# EAGLE design ESP_PILOT (EAGLE 9.6.2)
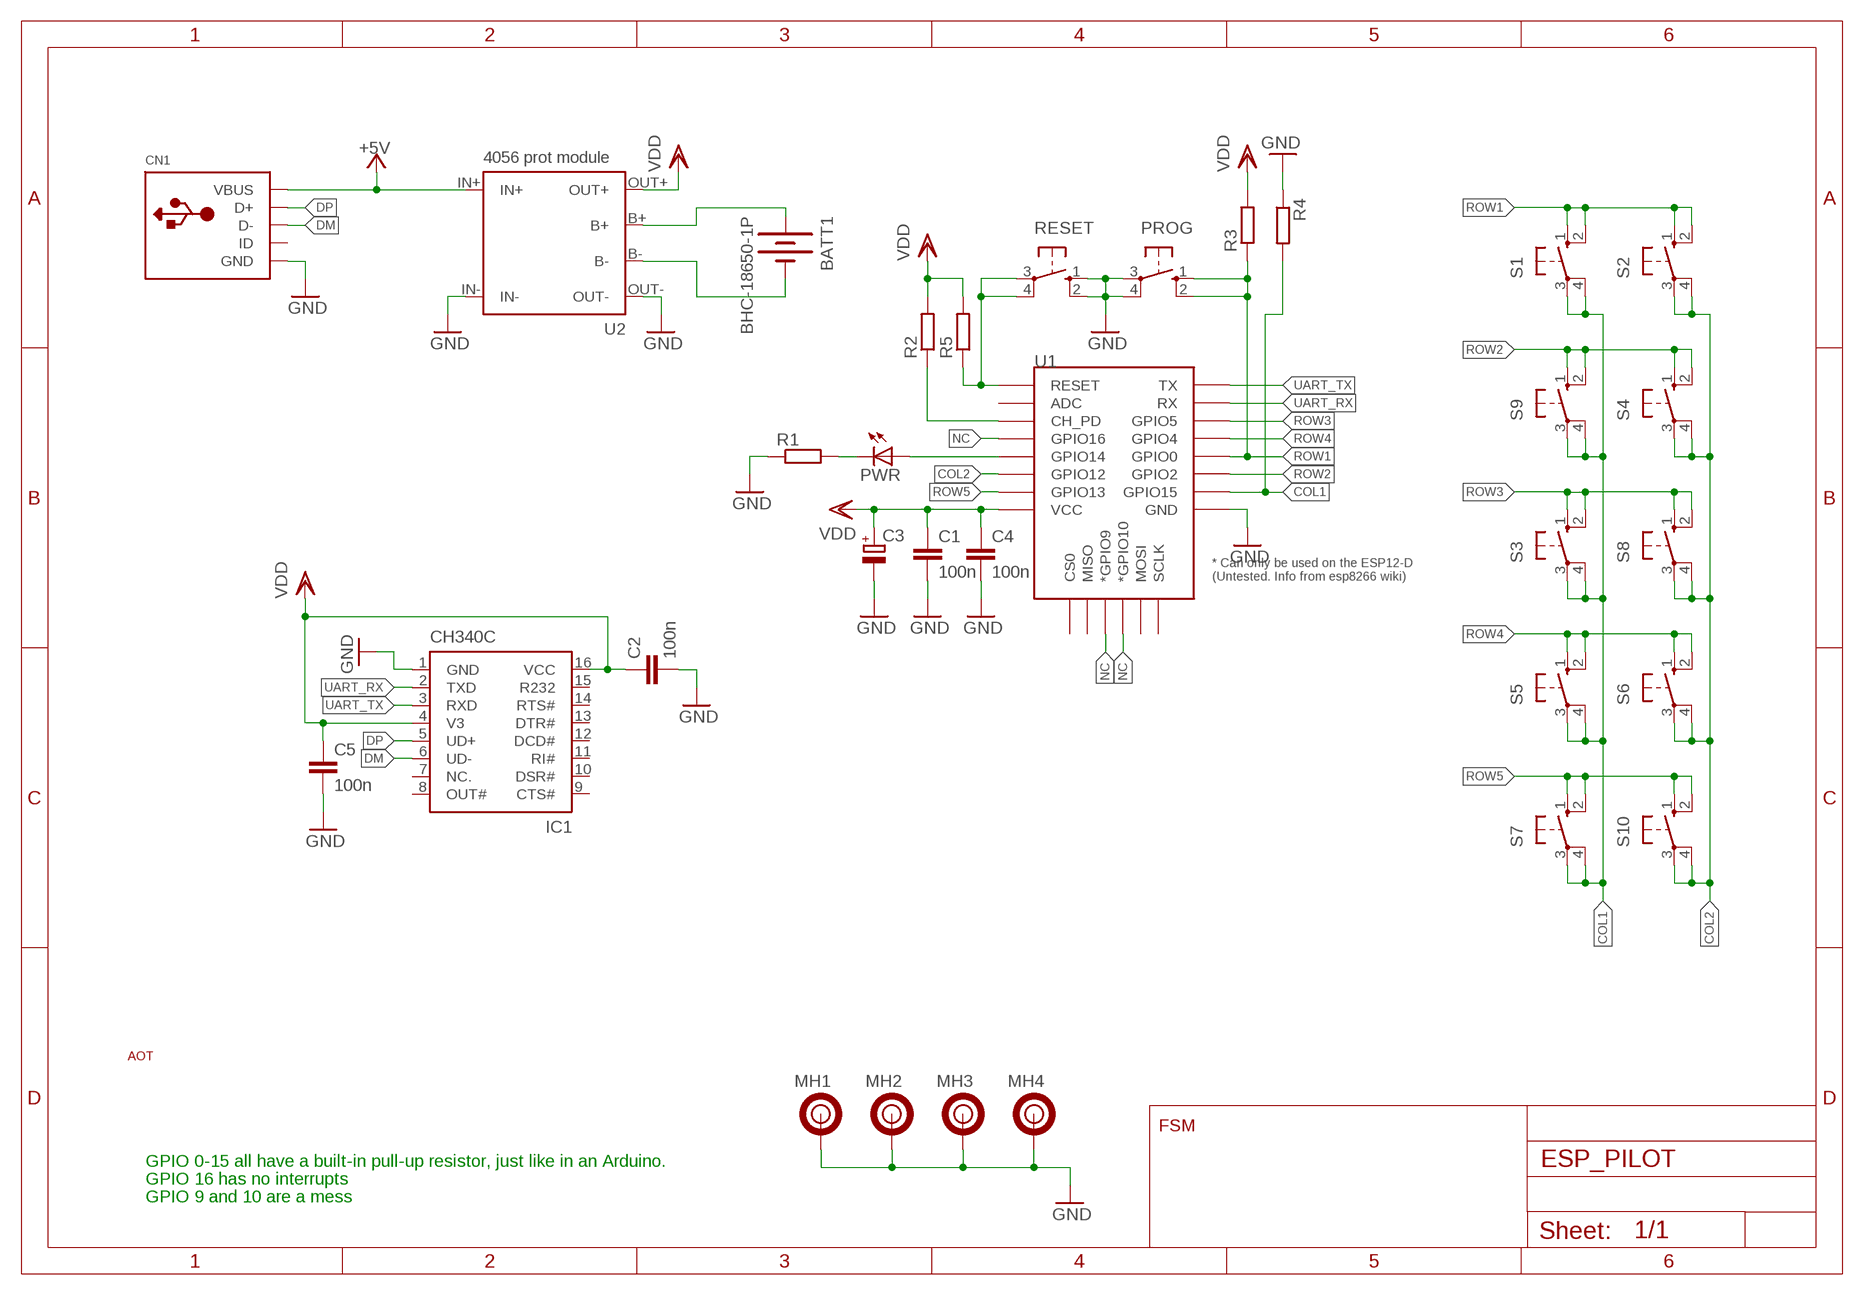
[diagram p0: schematic, sheet 1]

## Parts
BATT1  BHC-18650-1P  [BHC-18650-1P]
C1  100n  C-EU050-025X075  [C050-025X075]
C2  100n  C-EU050-025X075  [C050-025X075]
C3  CPOL-EUE2.5-7  [E2,5-7]
C4  100n  C-EU050-025X075  [C050-025X075]
C5  100n  C-EU050-025X075  [C050-025X075]
CN1  USBMINIB  [USB-MINIB]
IC1  CH340C  [SOIC16N]
MH1  MOUNTING_HOLE_3MM  [3MM_CONDUCTING]
MH2  MOUNTING_HOLE_3MM  [3MM_CONDUCTING]
MH3  MOUNTING_HOLE_3MM  [3MM_CONDUCTING]
MH4  MOUNTING_HOLE_3MM  [3MM_CONDUCTING]
PROG  10-XX  [B3F-10XX]
PWR  LED5MM  [LED5MM]
R1  R-EU_0207/10  [0207/10]
R2  R-EU_0207/10  [0207/10]
R3  R-EU_0207/10  [0207/10]
R4  R-EU_0207/10  [0207/10]
R5  R-EU_0207/10  [0207/10]
RESET  10-XX  [B3F-10XX]
S1  10-XX  [B3F-10XX]
S2  10-XX  [B3F-10XX]
S3  10-XX  [B3F-10XX]
S4  10-XX  [B3F-10XX]
S5  10-XX  [B3F-10XX]
S6  10-XX  [B3F-10XX]
S7  10-XX  [B3F-10XX]
S8  10-XX  [B3F-10XX]
S9  10-XX  [B3F-10XX]
S10  10-XX  [B3F-10XX]
U1  ESP12ESMD  [ESP12E-SMD]
U2  4056 prot module  TP4056_MICRO/MINI_PROT  [TP4056_MICRO/MINI_PROT]
U$1  FSM  [FSM]
U$2  AOT  [AOT]

## Nets
+5V: CN1.VBUS U2.IN+
COL1: R4.2 S1.3(P) S1.4(P1) S3.3(P) S3.4(P1) S5.3(P) S5.4(P1) S7.3(P) S7.4(P1) S9.3(P) S9.4(P1) U1.GPIO15
COL2: S2.3(P) S2.4(P1) S4.3(P) S4.4(P1) S6.3(P) S6.4(P1) S8.3(P) S8.4(P1) S10.3(P) S10.4(P1) U1.GPIO12
DM: CN1.D- IC1.6(UD-)
DP: CN1.D+ IC1.5(UD+)
GND: C1.2 C2.2 C3.- C4.2 C5.2 CN1.GND IC1.1(GND) MH1.1 MH1.2 MH1.3 MH1.4 MH1.5 MH1.6 MH1.7 MH1.8 MH1.O MH2.1 MH2.2 MH2.3 MH2.4 MH2.5 MH2.6 MH2.7 MH2.8 MH2.O MH3.1 MH3.2 MH3.3 MH3.4 MH3.5 MH3.6 MH3.7 MH3.8 MH3.O MH4.1 MH4.2 MH4.3 MH4.4 MH4.5 MH4.6 MH4.7 MH4.8 MH4.O PROG.3(P) PROG.4(P1) R1.1 R4.1 RESET.1(S) RESET.2(S1) U1.GND U2.IN- U2.OUT-
N$1: BATT1.-(+) U2.B+
N$2: BATT1.+(-) U2.B-
N$3: PWR.K(C) R1.2
N$4: R2.1 U1.CH_PD
N$5: PWR.A U1.GPIO14
N$7: R5.1 RESET.3(P) RESET.4(P1) U1.RESET
NC: U1.GPIO9(*GPIO9) U1.GPIO10(*GPIO10) U1.GPIO16
ROW1: PROG.1(S) PROG.2(S1) R3.1 S1.1(S) S1.2(S1) S2.1(S) S2.2(S1) U1.GPIO0
ROW2: S4.1(S) S4.2(S1) S9.1(S) S9.2(S1) U1.GPIO2
ROW3: S3.1(S) S3.2(S1) S8.1(S) S8.2(S1) U1.GPIO5
ROW4: S5.1(S) S5.2(S1) S6.1(S) S6.2(S1) U1.GPIO4
ROW5: S7.1(S) S7.2(S1) S10.1(S) S10.2(S1) U1.GPIO13
UART_RX: IC1.2(TXD) U1.RXD0(RX)
UART_TX: IC1.3(RXD) U1.TXD0(TX)
VDD: C1.1 C2.1 C3.+ C4.1 C5.1 IC1.4(V3) IC1.16(VCC) R2.2 R3.2 R5.2 U1.VCC U2.OUT+
Unconnected: CN1.ID IC1.7(NC.) IC1.8(OUT#) IC1.9(CTS#) IC1.10(DSR#) IC1.11(RI#) IC1.12(DCD#) IC1.13(DTR#) IC1.14(RTS#) IC1.15(R232) U1.ADC U1.CS0 U1.MISO U1.MOSI U1.SCLK

## Notes on the sheet
- GPIO 0-15 all have a built-in pull-up resistor, just like in an Arduino.
- GPIO 16 has no interrupts
- GPIO 9 and 10 are a mess

## Library data of the parts
BATT1 = battery:BHC-18650-1P: 18650 cell holder https://octopart.com/search?q=BHC-18650-1P&currency=USD&specs=0
C1 C2 C4 C5 = rcl:C-EU: CAPACITOR, European symbol; SPICEPREFIX: C
C3 = rcl:CPOL-EU: POLARIZED CAPACITOR, European symbol; SPICEPREFIX: C
CN1 = adafruit:USB: USB Connectors USBMINIB - Surface Mount Female Mini-B USB Connector 4UConnector: 06564 By microbuilder.eu Thru-hole RA Female Mini-B USB Connector 4UConnector: 18732 By ladyada.net
IC1 = CH340:CH340C; VALUE: CH340
MH1-MH4 = MOUNTING_PADS:MOUNTING_HOLE_3MM
PROG RESET S1-S10 = switch-omron:10-XX: OMRON SWITCH; MPN: B3F-1000; OC_FARNELL: 176432; OC_NEWARK: 36M3542
PWR = adafruit:LED: LED OSRAM: - CHIPLED LG R971, LG N971, LY N971, LG Q971, LY Q971, LO R971, LY R971 LH N974, LH R974 LS Q976, LO Q976, LY Q976 LO Q996 - Hyper CHIPLED LW Q18S LB Q993, LB Q99A, LB R99A - SideLED LS A670, LO A670, LY A670, LG A670, LP A670 LB A673, LV A673, LT A673, LW A673 LH A674 LY A675 LS A676, LA A676, LO A676, LY A676, LW A676 LS A679, LY A679, LG A679 - Hyper Micro SIDELED® LS Y876, LA Y876, LO Y876, LY Y876 LT Y87S - SmartLED LW L88C, LW L88S LB L89C, LB L89S, LG L890 LS L89K, LO L89K, LY L89K LS L896, LA L896, LO L896, LY L896 - TOPLED LS T670, LO T670, LY T670, LG T670, LP T670 LSG T670, LSP T670, LSY T670, LOP T670, LYG T670 LG T671, LOG T671, LSG T671 LB T673, LV T673, LT T673, LW T673 LH T674 LS T676, LA T676, LO T676, LY T676, LB T676, LH T676, LSB T676, LW T676 LB T67C, LV T67C, LT T67C, LS T67K, LO T67K, LY T67K, LW E67C LS E67B, LA E67B, LO E67B, LY E67B, LB E67C, LV E67C, LT E67C LW T67C LS T679, LY T679, LG T679 LS T770, LO T770, LY T770, LG T770, LP T770 LB T773, LV T773, LT T773, LW T773 LH T774 LS E675, LA E675, LY E675, LS T675 LS T776, LA T776, LO T776, LY T776, LB T776 LHGB T686 LT T68C, LB T68C - Hyper Mini TOPLED® LB M676 - Mini TOPLED Santana® LG M470 LS M47K, LO M47K, LY M47K Source: http://www.osram.convergy.de/
R1-R5 = rcl:R-EU_: RESISTOR, European symbol; SPICEPREFIX: R
U1 = esp8266modules:ESP12E: ESP12E Module
U2 = powerModules:TP4056_MICRO/MINI_PROT
U$1 = FSM:FSM
U$2 = AOT:AOT

## Board
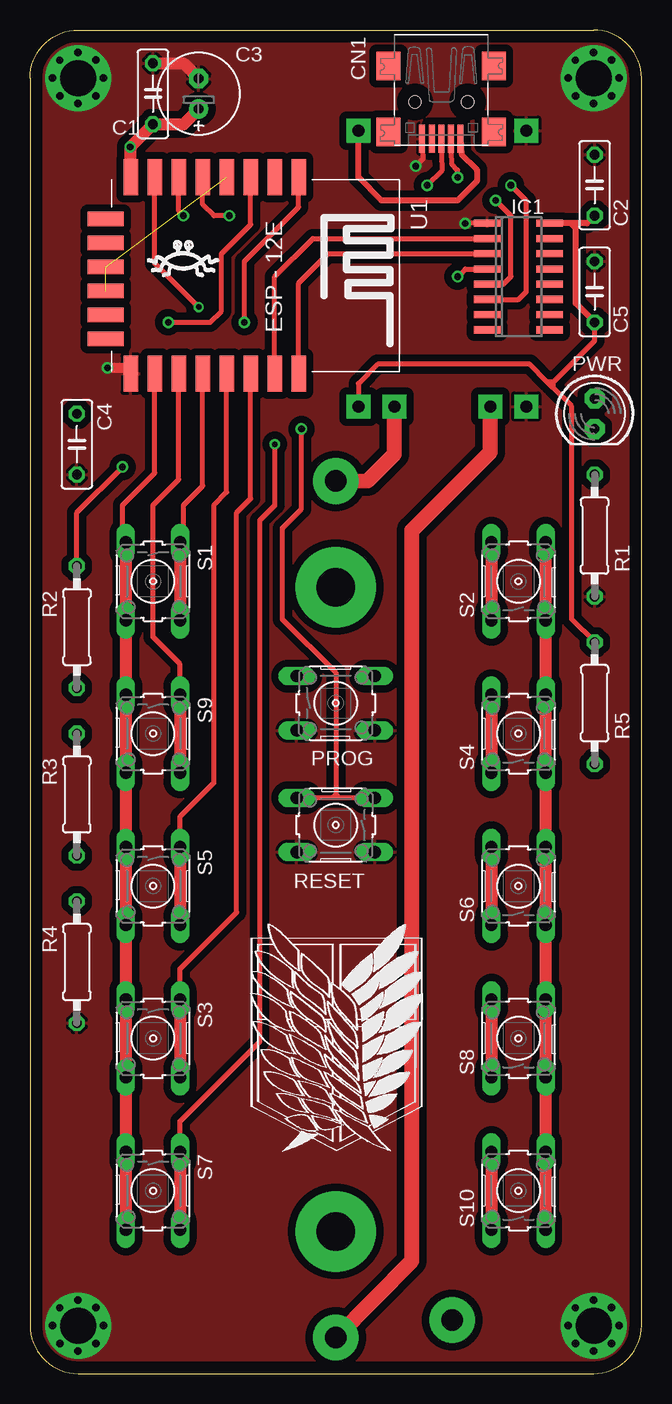
[diagram p1: board, top side]
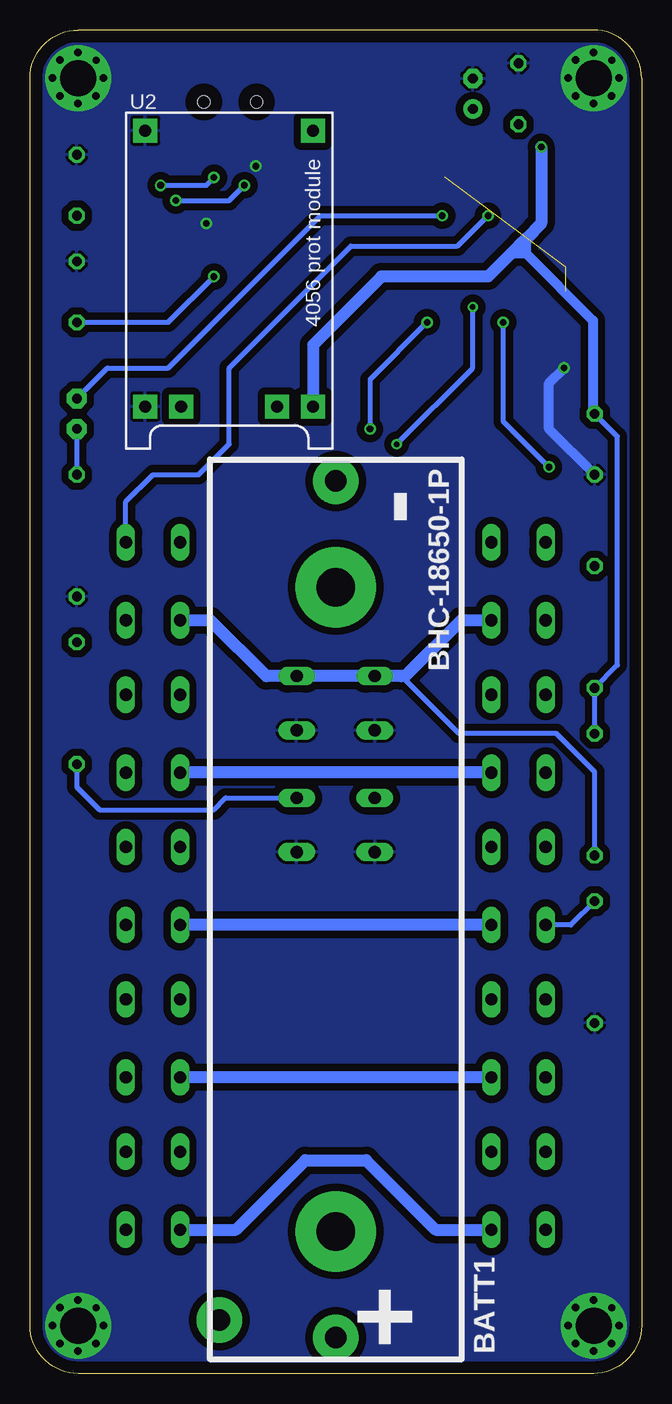
[diagram p2: board, bottom side, seen from below]

Size 51 x 112 mm. Coordinates in mm from the lower left corner, seen from the top.
Outline: 4,0 47,0 arc90 51,4 51,108 arc90 47,112 4,112 arc90 0,108 0,4 arc90 4,0
Copper layers (1*16): Top 0.035mm / dielectric 1.5mm / Bottom 0.035mm
Design rules "default": minimum track width 6mil, minimum drill 0.35mm, track to track 6mil, track to pad 6mil, pad to pad 6mil, via to via 6mil, smd to smd 6mil, copper to edge 40mil, drill to drill 6mil, minimum pad ring 10mil, minimum via ring 8mil, stop-mask expansion 4mil, vias tented up to drill 0mil, thermal gap 10mil

### Footprints (pad centres in the part's own frame; a part is rotated, then mirrored left to right if it is on the bottom)
BHC-18650-1P = drill 1.8 pad 3.81: + 35.7,0; - -35.7,0; P$3 34.24,-9.7 | drill 3.2 pad 6.7: MOUNT@1 -26.85,0; MOUNT@2 26.85,0
C050-025X075 = drill 0.813 octagon: 1 -2.54,0; 2 2.54,0
E2,5-7 = drill 0.813 pad 1.6: + -1.27,0 | drill 0.813 pad 1.6 octagon: - 1.27,0
USB-MINIB = smd 0.5 x 2.308: D+ 0,4.064; D- -0.8,4.064; GND 1.6,4.064; ID 0.8,4.064; VBUS -1.6,4.064 | smd 2 x 2.4: GND1 -4.4,-2; GND2 -4.4,3.5; GND3 4.4,3.5; GND4 4.4,-2 | hole 1: -2.2,1; 2.2,1
SOIC16N = smd 0.6 x 2.2: 1 -4.445,-2.6; 2 -3.175,-2.6; 3 -1.905,-2.6; 4 -0.635,-2.6; 5 0.635,-2.6; 6 1.905,-2.6; 7 3.175,-2.6; 8 4.445,-2.6; 9 4.445,2.6; 10 3.175,2.6; 11 1.905,2.6; 12 0.635,2.6; 13 -0.635,2.6; 14 -1.905,2.6; 15 -3.175,2.6; 16 -4.445,2.6
3MM_CONDUCTING = drill 0.6: 1 -2.125,0; 2 -1.51,1.487; 3 -0.007,2.121; 4 1.493,1.496; 5 2.125,0; 6 1.493,-1.504; 7 -0.007,-2.121; 8 -1.507,-1.504 | drill 3 pad 5.5: O 0,0
B3F-10XX = drill 1.016 long: 1 -3.251,2.261; 2 3.251,2.261; 3 -3.251,-2.261; 4 3.251,-2.261
LED5MM = drill 0.813 pad 1.676 octagon: A -1.27,0; K 1.27,0
0207/10 = drill 0.813 octagon: 1 -5.08,0; 2 5.08,0
ESP12E-SMD = smd 3 x 1.2: ADC -8.3,3.8; CH_PD -8.3,1.8; GND 8.1,-8.2; GPIO0 8.1,-2.2; GPIO2 8.1,-4.2; GPIO4 8.1,-0.2; GPIO5 8.1,1.8; GPIO12 -8.3,-4.2; GPIO13 -8.3,-6.2; GPIO14 -8.3,-2.2; GPIO15 8.1,-6.2; GPIO16 -8.3,-0.2; RESET -8.3,5.8; RXD0 8.1,3.8; TXD0 8.1,5.8; VCC -8.3,-8.2 | smd 1.2 x 3: CS0 -4.8,-10.3; GPIO9 -0.8,-10.3; GPIO10 1.2,-10.3; MISO -2.8,-10.3; MOSI 3.2,-10.3; SCLK 5.2,-10.3
TP4056_MICRO/MINI_PROT = drill 1 pad 2 square: B+ 10.5,4; B- 10.5,-4; IN+ -12.5,7; IN- -12.5,-7; OUT+ 10.5,7; OUT- 10.5,-7

### Placement (x,y rotation side)
BATT1  25.5,38.7 270 bottom
C1  10.26,106.68 90 top
C2  47.09,99.06 90 top
C3  14.07,106.68 90 top
C4  3.91,77.47 270 top
C5  47.09,90.17 90 top
CN1  34.3,107 180 top
IC1  40.74,91.44 270 top
MH1  4,4 0 top
MH2  47,4 0 top
MH3  4,108 0 top
MH4  47,108 0 top
PROG  25.5,55.88 0 top
PWR  47.09,80.01 270 top
R1  47.09,69.85 90 top
R2  3.91,62.23 270 top
R3  3.91,48.26 90 top
R4  3.91,34.29 90 top
R5  47.09,55.88 90 top
RESET  25.5,45.72 180 top
S1  10.26,66.04 270 top
S2  40.74,66.04 90 top
S3  10.26,27.94 270 top
S4  40.74,53.34 90 top
S5  10.26,40.64 270 top
S6  40.74,40.64 90 top
S7  10.26,15.24 270 top
S8  40.74,27.94 90 top
S9  10.26,53.34 270 top
S10  40.74,15.24 90 top
U1  16.61,91.44 270 top
U2  34.39,91.12 270 bottom
U$1  12.8,92.71 0 top
U$2  32.75,18.5 0 bottom

### Tracks (layer width: path | path; a pad name or v marks a point on that pad's centre or on a via)
+5V
  Top 0.508: CN1.VBUS 35.99,101.66 37.26,100.39 37.26,100.33 37.26,99.39 35.66,97.79 29.31,97.79 27.39,99.71 U2.IN+
COL1
  Top 0.406: S1.3 7.72,69.57 7.72,72.39 10.41,75.08 U1.GPIO15
  Top 1.016: S1.3 S1.4 S9.3 S9.4 S5.3 S5.4 S3.3 S3.4 S7.3 S7.4
  Bottom 0.406: R4.2 5.89,37.39 S5.4
COL2  (via drill 0.55)
  Top 0.406: v12.8,96.52 12.41,96.91 U1.GPIO12
  Top 1.016: S10.3 S10.4 S8.3 S8.4 S6.3 S6.4 S4.3 S4.4 S2.3 S2.4
  Bottom 0.406: v12.8,96.52 15.34,93.98 24.23,93.98 34.39,83.82 34.39,77.47 36.93,74.93 40.74,74.93 43,72.67 S2.4
DM  (via drill 0.55)
  Top 0.406: IC1.6 40.74,89.53 41.38,90.17 41.38,97.79 v40.1,99.06 | v35.66,99.69 35.66,100.33 35.19,100.8 CN1.D-
  Bottom 0.406: v40.1,99.06 36.3,99.06 v35.66,99.69
DP  (via drill 0.55)
  Top 0.406: IC1.5 39.47,90.81 40.1,91.44 40.1,96.52 v38.84,97.79 | v33.12,99.06 34.39,100.33 CN1.D+
  Bottom 0.406: v38.84,97.79 34.39,97.79 v33.12,99.06
GND  (via drill 0.55)
  Top 0.406: CN1.GND 32.79,101.27 v32.17,100.65 | IC1.1 v36.3,95.89
  Top 0.508: U1.GND 8.41,84.51
  Top 0.813: U1.GND 7.93,83.82 v6.45,83.82
  Top 1.016: C1.2 12.8,109.22 C3.-
  Bottom 0.813: C4.2 7.72,78.74 7.72,82.55 v6.45,83.82
  pour Bottom (isolate 0.61): 0,0 0,108.1 arc-90 4,112 47,112 arc-90 51,108 51,4 arc-90 47,0
  pour Top (isolate 0.61): 0,0 0,108.1 arc-90 4,112 47,112 arc-90 51,108 51,4 arc-90 47,0
N$1
  Top 1.27: BATT1.- 28.18,74.44 30.39,76.64 U2.B+
N$2
  Top 1.27: BATT1.+ 31.85,9.38 31.85,70.27 38.39,76.81 U2.B-
N$3
  Bottom 0.406: PWR.K R1.2
N$4  (via drill 0.55)
  Top 0.406: R2.1 3.91,71.75 v7.72,75.56 | U1.CH_PD 18.41,95.78 15.97,93.34 15.97,88.58 15.02,87.63 v11.53,87.63
  Bottom 0.406: v7.72,75.56 11.53,79.38 v11.53,87.63
N$5  (via drill 0.55)
  Top 0.406: v16.61,96.52 15.34,96.52 14.41,97.45 U1.GPIO14
  Bottom 0.406: PWR.A 44.55,83.82 39.47,83.82 26.77,96.52 v16.61,96.52
N$7  (via drill 0.55)
  Top 0.406: RESET.3 25.78,47.98 | 25.78,47.98 25.5,47.98 | 25.5,47.98 25.22,47.98 | 25.22,47.98 RESET.4 | 25.5,47.98 25.5,48.26 | 25.5,48.26 25.5,58.42 21.05,62.87 21.05,70.48 22.64,72.07 v22.64,78.74 | v17.88,87.63 17.88,92.71 22.41,97.24 U1.RESET | 25.5,48.26 25.22,47.98 | 25.5,48.26 25.78,47.98
  Bottom 0.406: v22.64,78.74 22.64,82.87 v17.88,87.63 | R5.1 47.09,48.9 45.19,46.99 35.66,46.99 34.67,47.98 RESET.3
NC  (2 unrouted)
ROW1
  Top 0.406: S1.1 12.8,69.57 12.8,72.39 14.41,74 U1.GPIO0
  Top 1.016: S2.2 S2.1 | S1.1 S1.2
  Bottom 0.406: R3.1 3.91,50.16 7.08,53.34 15.23,53.34 20.03,58.14
  Bottom 1.016: S2.1 35.94,62.79 31.29,58.14 PROG.2 PROG.1 20.03,58.14 19.71,58.14 15.06,62.79 S1.2
ROW2
  Top 0.406: S9.1 12.52,59.13 10.26,61.39 10.26,72.39 12.41,74.54 U1.GPIO2
  Top 1.016: S4.2 S4.1 | S9.1 S9.2
  Bottom 1.016: S9.2 S4.1
ROW3
  Top 0.406: S3.1 12.52,33.73 17.25,38.46 17.25,71.75 18.41,72.92 U1.GPIO5
  Top 1.016: S3.1 S3.2 | S8.2 S8.1
  Bottom 1.016: S3.2 S8.1
ROW4
  Top 0.406: S5.1 12.52,46.43 15.34,49.25 15.34,72.39 16.41,73.46 U1.GPIO4
  Top 1.016: S5.1 S5.2 | S6.2 S6.1
  Bottom 1.016: S5.2 S6.1
ROW5  (via drill 0.45)
  Top 0.406: S7.1 12.52,21.03 19.15,27.66 19.15,71.12 20.42,72.39 v20.42,77.47 | v14.07,88.9 10.41,92.56 U1.GPIO13
  Top 1.016: S7.1 S7.2 | S10.2 S10.1
  Bottom 0.406: v20.42,77.47 14.07,83.82 v14.07,88.9
  Bottom 1.016: S10.1 33.83,11.99 28.04,17.78 22.96,17.78 17.17,11.99 S7.2
UART_RX
  Top 0.406: U1.RXD0 20.41,91.43 23.59,94.61 IC1.2
UART_TX
  Top 0.406: U1.TXD0 22.41,90.89 24.86,93.34 IC1.3
VDD  (via drill 0.55)
  Top 0.406: R5.2 45.19,62.87 45.19,80.64 43.66,82.17 | U2.OUT+ 27.39,82.53 28.99,84.14 41.69,84.14 43.16,82.67 | 43.66,82.17 43.41,82.42 | 43.41,82.42 43.16,82.67 | v35.66,91.44 36.3,92.08 IC1.4 | 43.41,82.42 43.66,82.67 | 43.66,82.67 47.09,86.09 C5.1 | 43.66,82.17 43.66,82.67 | 43.66,82.67 43.16,82.67
  Top 0.508: C2.1 46.45,95.89 45.88,95.89 | 45.88,95.89 45.5,95.89 | 45.5,95.89 45.12,95.89 | 45.12,95.89 IC1.16 | C5.1 45.5,89.22 45.5,95.5 | 45.5,95.89 45.5,95.5 | 45.12,95.89 45.5,95.5 | 45.88,95.89 45.5,95.5
  Top 1.016: U1.VCC 8.41,102.18 v8.36,102.23 C1.1 12.8,104.14 C3.+
  Bottom 0.406: 4.06,80.16 2,78.11 2,59.05 R2.2 R3.2 | C5.1 39.47,87.63 v35.66,91.44
  Bottom 0.813: 9.62,93.34 4.06,87.78 4.06,80.16 C4.1 | 9.62,93.34 10.26,93.98 | 9.62,93.34 9.62,94.61 | 9.62,93.34 10.89,93.34
  Bottom 1.016: v8.36,102.23 8.36,95.89 9.62,94.61 10.26,93.98 10.89,93.34 12.8,91.44 21.69,91.44 27.39,85.74 U2.OUT+